# Altium schematic sheet ISOW7844DWE.SchDoc
size 209 x 297 mm; Address1: Address1; Address2: Address2; Address3: Address3; Address4: Address4; SheetNumber: 1; Scale: 1:1; Разраб.: Иванов; Обозначение документа: АБВГ.123456.001 Э3; Пров.: Петров; Утв.: Сидоров; Наименование организации: ОАО "Концерн "МПО-Гидроприбор"; Перв. применение: АБВГ.123456.000; Наименование изделия 1: Плата; Наименование изделия 2: Схема электрическая; Наименование изделия 3: принципиальная; Нач. отд.: Нач. отд.; Фамилия нач. отд.: Сидоров
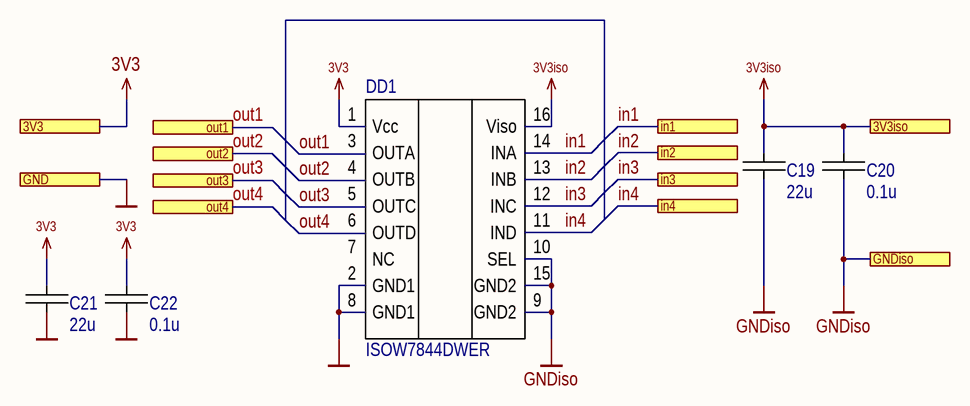
[diagram p0: ISOW7844DWE.SchDoc]

## Parts
C19  22u  [C0805_IPC]
C20  0.1u  [C0603_IPC]
C21  22u  [C0805_IPC]
C22  0.1u  [C0603_IPC]
DD1  ISOW7844DWER  [SOIC16W]

## Ports
3V3, 3V3iso, GND, GNDiso, in1, in2, in3, in4, out1, out2, out3, out4

## Nets
3V3: C21.1 C22.1 DD1.1(NC) ; port 3V3
3V3iso: C19.1 C20.1 DD1.16(Viso) ; port 3V3iso
GND: C21.2 C22.2 DD1.2(NC) DD1.8(GND1) ; port GND
GNDiso: C19.2 C20.2 DD1.9(GND2) DD1.10(SEL) DD1.15(GND2) ; port GNDiso
in1: DD1.14(INA) ; port in1
in2: DD1.13(INB) ; port in2
in3: DD1.12(INC) ; port in3
in4: DD1.11(IND) ; port in4

Not connected (* = marked no-connect by the designer): DD1 3(OUTA) 4(OUTB) 5(OUTC) 6(OUTD) 7(NC)

## Notes on the sheet
- out1
- out2
- out3
- out4
- Перв. примен.
- Справ. №
- Подп. и дата
- Инв. № дубл.
- Взам. инв. №
- Разраб.
- Изм.
- Лист
- № докум.
- Подп.
- Дата
- Лит.
- Масса
- Масштаб
- Пров.
- Т.контр.
- Листов
- Инв. № подл.
- Утв.
- Н.контр.
- Копировал
- Формат А4

## Library data of the parts
C19 C21 = 22u 6.3V: 22µF ±20% 6.3V Ceramic Capacitor X5R 0805 (2012 Metric); MPN: CL21A226MQQNNNE; Manufacturer: Samsung Electro-Mechanics; Tolerance: 0.2; Name: 22u 6.3V; Value: 22u; Voltage/Power: 6.3V; LibraryPath: sch\cap.schlib; FootprintPath: pcb\capSmd.pcblib; ComponentLink2URL: https://www.digikey.com/product-detail/en/samsung-electro-mechanics/CL21A226MQQNNNE/1276-1100-2-ND/3886758; ComponentLink2Description: site; Type: X5R; price elitan 1000pc: 1.67; price terra 1000pc: 1.6
C20 C22 = 0.1u 50V: 0.1uF ±10% 50V Ceramic Capacitor X7R 0603 (1608 Metric); MPN: CL10B104KB8NNND; Manufacturer: Samsung; Tolerance: 0,1; Name: 0.1u 50V; Voltage/Power: 50V; LibraryPath: _library\sch\cap.schlib; FootprintPath: _library\pcb\capSmd.pcblib; ComponentLink2URL: https://www.digikey.com/product-detail/en/yageo/CC0603KRX7R9BB104/311-1344-2-ND/2103082; ComponentLink2Description: site; Type: X7R; price elitan 1000pc: 0.63; price terra 1000pc: 0.65; Value: 0.1u
DD1 = ISOW7844DWER: General Purpose Digital Isolator 5000Vrms 4 Channel 100Mbps 100kV/µs CMTI 16-SOIC (0.295", 7.50mm Width); Manufacturer: Texas Instruments; Name: ISOW7844DWER; MPN: ISOW7844DWER; ComponentLink2URL: https://www.digikey.com/product-detail/en/texas-instruments/ISOW7844DWER/296-51221-1-ND/9745585; ComponentLink2Description: site